# EAGLE schematic PDU_v3.1 (EAGLE 9.6.2)

## Sheet 1 of 11: PC104 Header
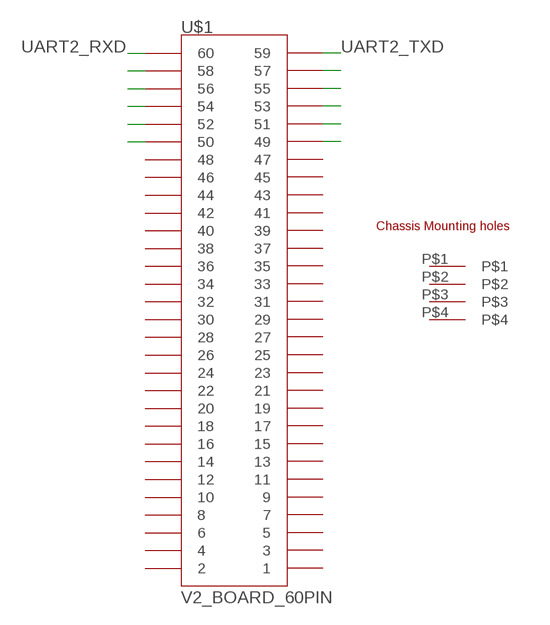
[diagram p0: schematic, sheet 1]

### Parts
U$1  V2_BOARD_60PIN  [PC104_WCONN_BACKPLANE_HEADER]

### Nets
N$22: U$1.57
N$23: U$1.55
N$24: U$1.53
N$32: U$1.58
N$33: U$1.56
N$34: U$1.54
N$35: U$1.52
N$36: U$1.51
N$37: U$1.49
N$39: U$1.50
UART2_RXD: U$1.60 ; also sheet 2
UART2_TXD: U$1.59 ; also sheet 2
Unconnected: U$1.1 U$1.2 U$1.3 U$1.4 U$1.5 U$1.6 U$1.7 U$1.8 U$1.9 U$1.10 U$1.11 U$1.12 U$1.13 U$1.14 U$1.15 U$1.16 U$1.17 U$1.18 U$1.19 U$1.20 U$1.21 U$1.22 U$1.23 U$1.24 U$1.25 U$1.26 U$1.27 U$1.28 U$1.29 U$1.30 U$1.31 U$1.32 U$1.33 U$1.34 U$1.35 U$1.36 U$1.37 U$1.38 U$1.39 U$1.40 U$1.41 U$1.42 U$1.43 U$1.44 U$1.45 U$1.46 U$1.47 U$1.48 U$1.P$1 U$1.P$2 U$1.P$3 U$1.P$4

## Sheet 2 of 11: Connectors
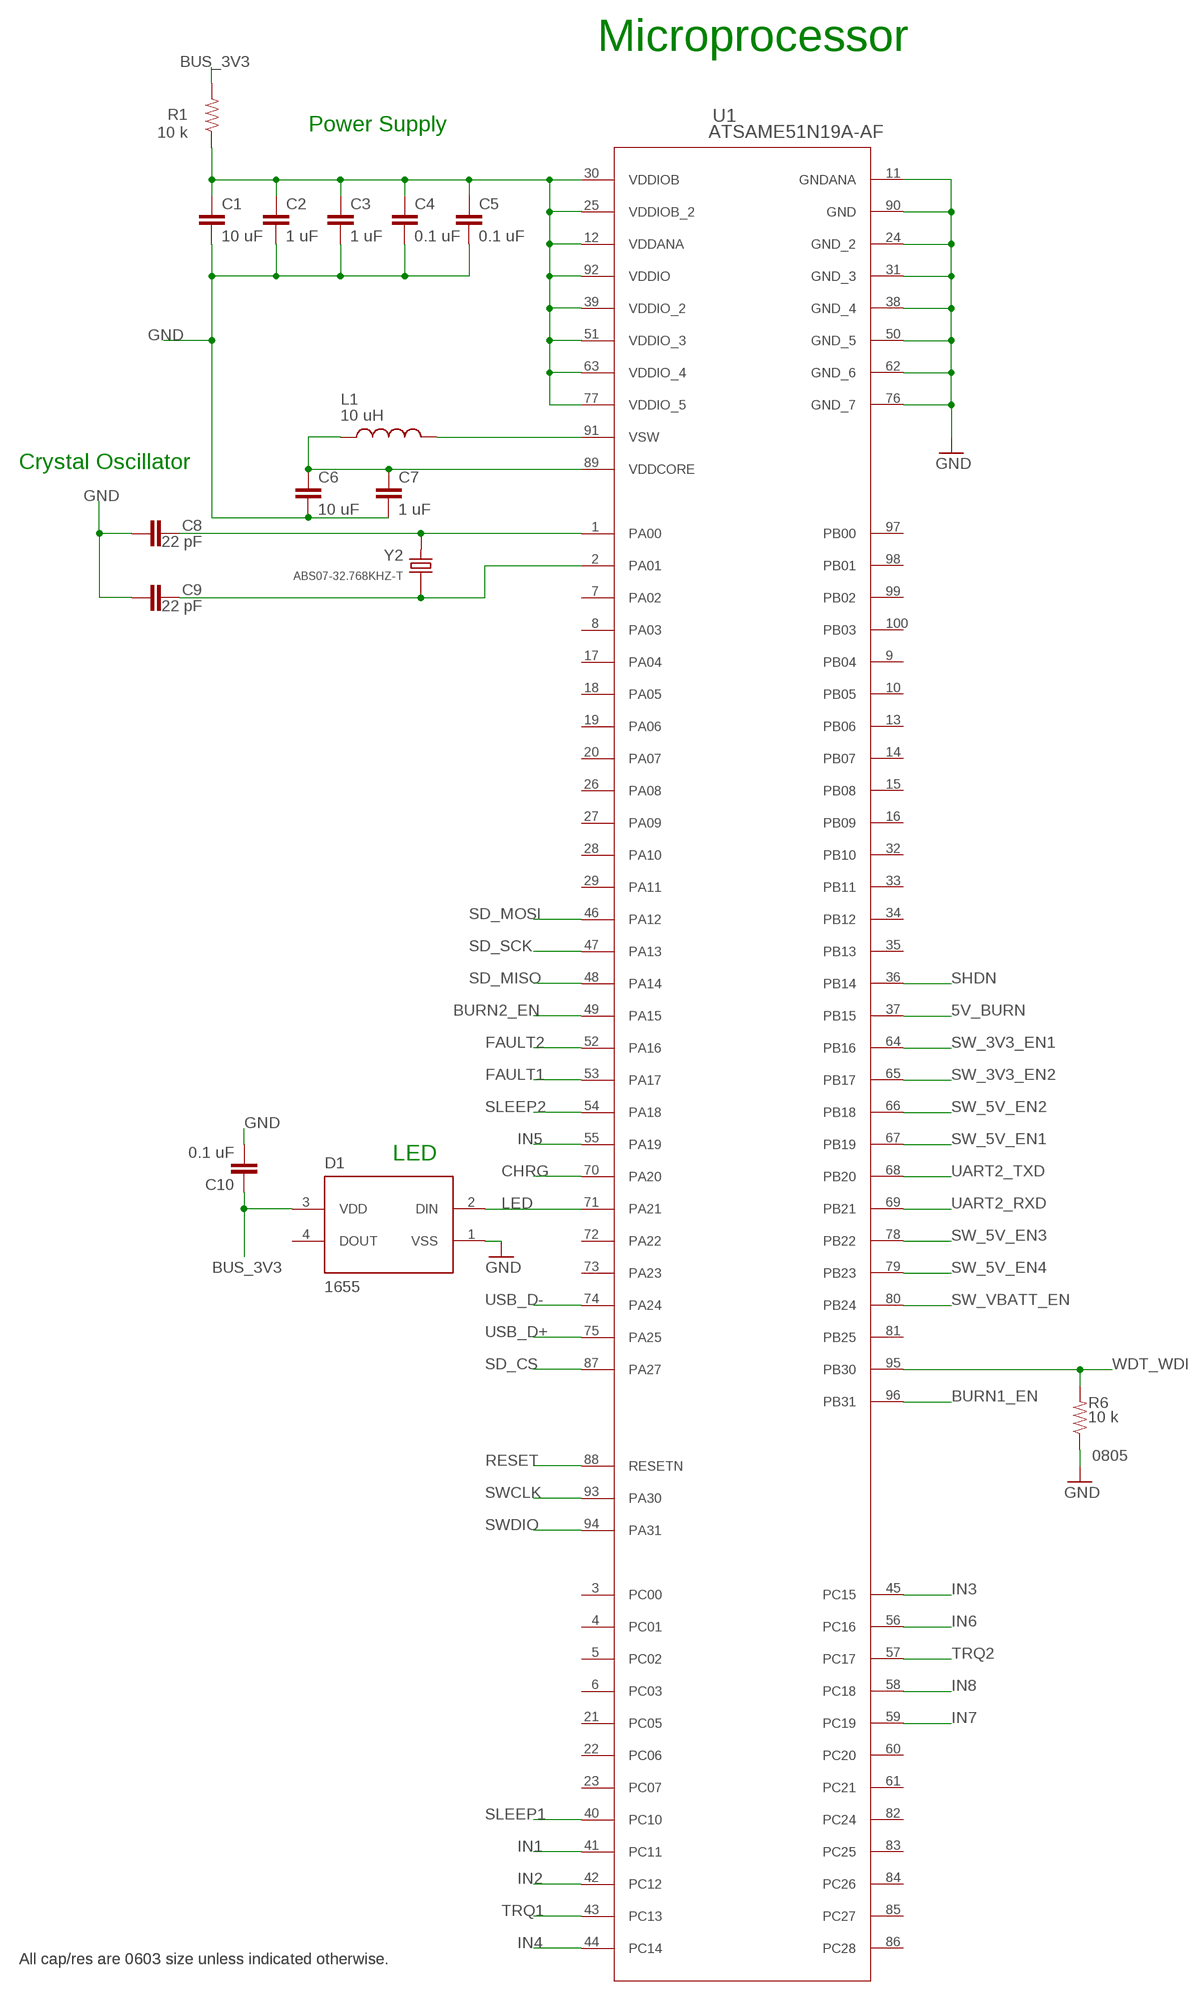
[diagram p1: schematic, sheet 2]

### Parts
C1  10 uF  CAP0603-CAP  [0603-CAP]
C2  1 uF  CAP0603-CAP  [0603-CAP]
C3  1 uF  CAP0603-CAP  [0603-CAP]
C4  0.1 uF  CAP0603-CAP  [0603-CAP]
C5  0.1 uF  CAP0603-CAP  [0603-CAP]
C6  10 uF  CAP0603-CAP  [0603-CAP]
C7  1 uF  CAP0603-CAP  [0603-CAP]
C8  22 pF  CAP0603-CAP  [0603-CAP]
C9  22 pF  CAP0603-CAP  [0603-CAP]
C10  0.1 uF  CAP0603-CAP  [0603-CAP]
D1  1655  [LED_1655]
L1  10 uH  CBL2012T100M  [INDC2012X100N]
R1  10 k  RESISTOR0603-RES  [0603-RES]
R6  10 k  RESISTOR0805-RES  [0805]
U1  ATSAME51N19A-AF  [TQFP100_14X14MC_MCH]
Y2  ABS07-32.768KHZ-T  [XTAL_ABS07-32.768KHZ-T]

### Nets
5V_BURN: U1.37(PB15)
BURN1_EN: U1.96(PB31)
BURN2_EN: U1.49(PA15)
BUS_3V3: C10.1 D1.3(VDD) R1.2
CCO_2: C8.2 U1.1(PA00) Y2.2
CCO_3: C9.2 U1.2(PA01) Y2.1
CHRG: U1.70(PA20)
FAULT1: U1.53(PA17)
FAULT2: U1.52(PA16)
GND: C1.2 C2.2 C3.2 C4.2 C5.2 C6.2 C7.2 C8.1 C9.1 C10.2 D1.1(VSS) R6.1 U1.11(GNDANA) U1.24(GND_2) U1.31(GND_3) U1.38(GND_4) U1.50(GND_5) U1.62(GND_6) U1.76(GND_7) U1.90(GND) ; also sheet 3
IN1: U1.41(PC11)
IN2: U1.42(PC12)
IN3: U1.45(PC15)
IN4: U1.44(PC14)
IN5: U1.55(PA19)
IN6: U1.56(PC16)
IN7: U1.59(PC19)
IN8: U1.58(PC18)
LED: D1.2(DIN) U1.71(PA21)
N$1: C6.1 C7.1 L1.1 U1.89(VDDCORE)
N$2: L1.2 U1.91(VSW)
RESET: U1.88(RESETN)
SD_CS: U1.87(PA27)
SD_MISO: U1.48(PA14)
SD_MOSI: U1.46(PA12)
SD_SCK: U1.47(PA13)
SHDN: U1.36(PB14)
SLEEP1: U1.40(PC10)
SLEEP2: U1.54(PA18)
SW_3V3_EN1: U1.64(PB16)
SW_3V3_EN2: U1.65(PB17)
SW_5V_EN1: U1.67(PB19)
SW_5V_EN2: U1.66(PB18)
SW_5V_EN3: U1.78(PB22)
SW_5V_EN4: U1.79(PB23)
SW_VBATT_EN: U1.80(PB24)
SWCLK: U1.93(PA30)
SWDIO: U1.94(PA31)
TRQ1: U1.43(PC13)
TRQ2: U1.57(PC17)
UART2_RXD: U1.69(PB21) ; also sheet 1
UART2_TXD: U1.68(PB20) ; also sheet 1
USB_D+: U1.75(PA25)
USB_D-: U1.74(PA24)
VDD2: C1.1 C2.1 C3.1 C4.1 C5.1 R1.1 U1.12(VDDANA) U1.25(VDDIOB_2) U1.30(VDDIOB) U1.39(VDDIO_2) U1.51(VDDIO_3) U1.63(VDDIO_4) U1.77(VDDIO_5) U1.92(VDDIO)
WDT_WDI: R6.2 U1.95(PB30)
Unconnected: D1.4(DOUT) U1.3(PC00) U1.4(PC01) U1.5(PC02) U1.6(PC03) U1.7(PA02) U1.8(PA03) U1.9(PB04) U1.10(PB05) U1.13(PB06) U1.14(PB07) U1.15(PB08) U1.16(PB09) U1.17(PA04) U1.18(PA05) U1.19(PA06) U1.20(PA07) U1.21(PC05) U1.22(PC06) U1.23(PC07) U1.26(PA08) U1.27(PA09) U1.28(PA10) U1.29(PA11) U1.32(PB10) U1.33(PB11) U1.34(PB12) U1.35(PB13) U1.60(PC20) U1.61(PC21) U1.72(PA22) U1.73(PA23) U1.81(PB25) U1.82(PC24) U1.83(PC25) U1.84(PC26) U1.85(PC27) U1.86(PC28) U1.97(PB00) U1.98(PB01) U1.99(PB02) U1.100(PB03)

### Notes on the sheet
- Microprocessor
- Power Supply
- Crystal Oscillator
- LED
- 0805
- All cap/res are 0603 size unless indicated otherwise. | All cap/res are 0603 size unless indicated otherwise.

## Sheet 3 of 11: H-Bridge Circuits
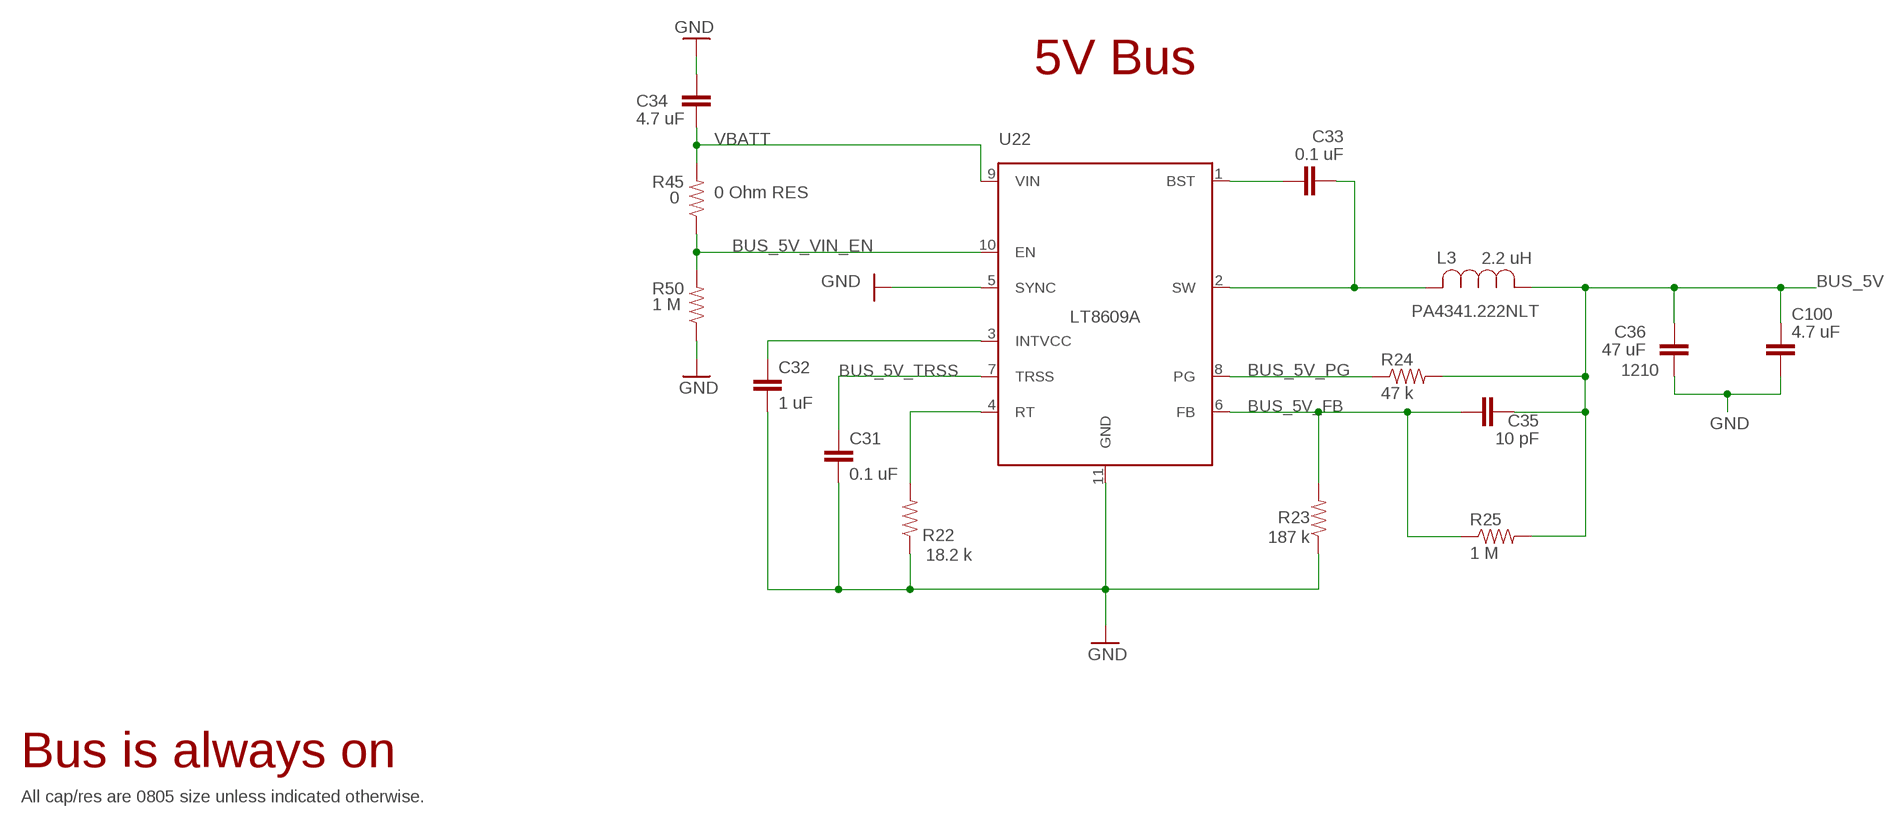
[diagram p2: schematic, sheet 3]

### Parts
C31  0.1 uF  CAP0805  [0805]
C32  1 uF  CAP0805  [0805]
C33  0.1 uF  CAP0805  [0805]
C34  4.7 uF  CAP0805  [0805]
C35  10 pF  CAP0805  [0805]
C36  47 uF  CAP1210  [1210]
C100  4.7 uF  CAP0805  [0805]
L3  PA4341.222NLT  [IND_222NLT_PUL]
R22  18.2 k  RESISTOR0805-RES  [0805]
R23  187 k  RESISTOR0805-RES  [0805]
R24  47 k  RESISTOR0805-RES  [0805]
R25  1 M  RESISTOR0805-RES  [0805]
R45  0  RESISTOR0805-RES  [0805]
R50  1 M  RESISTOR0805-RES  [0805]
U22  LT8609A  [MSOP-10_MSE]

### Nets
BUS_5V: C35.2 C36.1 C100.1 L3.1 R24.2 R25.2
BUS_5V_FB: C35.1 R23.2 R25.1 U22.6(FB)
BUS_5V_PG: R24.1 U22.8(PG)
BUS_5V_TRSS: C31.1 U22.7(TRSS)
BUS_5V_VIN_EN: R45.1 R50.2 U22.10(EN)
GND: C31.2 C32.2 C34.2 C36.2 C100.2 R22.1 R23.1 R50.1 U22.5(SYNC) U22.11(GND) ; also sheet 2
N$25: R22.2 U22.4(RT)
N$27: C32.1 U22.3(INTVCC)
N$28: C33.1 U22.1(BST)
N$29: C33.2 L3.2 U22.2(SW)
VBATT: C34.1 R45.2 U22.9(VIN)

### Notes on the sheet
- 5V Bus
- 0 Ohm RES
- 2.2 uH
- 1210
- Bus is always on
- All cap/res are 0805 size unless indicated otherwise.

## Sheet 4 of 11: Switches 1

### Notes on the sheet
- Switches (3V3, 5V, VBATT)

## Sheet 5 of 11: Switches 2

## Sheet 6 of 11: Bus (3V3, 5V)

## Sheet 7 of 11: 5V Burn

## Sheet 8 of 11: Microprocessor

## Sheet 9 of 11: Sensors (Current, Temperature)

## Sheet 10 of 11: Battery Charging

## Sheet 11 of 11

## Library data of the parts
C1-C10 C31-C36 C100 = HSFL_Main_Library:CAP: Capacitor Standard 0603 ceramic capacitor, and 0.1" leaded capacitor.
D1 = Artemis:1655: Ws2812b 5050 Rgb Led With Integrated Driver Chip Pack Of 10; DESCRIPTION: Ws2812b 5050 Rgb Led With Integrated Driver Chip Pack Of 10; MF: Adafruit; MP: 1655; PACKAGE: Adafruit
L1 = Artemis:CBL2012T100M: Power Inductor; Inductor Type:Power; Series:CBL; Inductance:10µH; Inductance Tolerance:± 20%; DC Resistance Max:1.3ohm; DC Current Rating:205mA; Package/Case:0805; Current Rating:205mA; Leaded Process Compatible:Yes ;RoHS Compliant: Yes; DESCRIPTION: 10µH Unshielded Wirewound Inductor 370mA 1.3Ohm Max 0805 (2012 Metric); DIGI-KEY_PART_NUMBER: 587-1632-1-ND; MF: Taiyo Yuden; MP: CBL2012T100M; PACKAGE: 2012 Taiyo Yuden
L3 = Artemis:PA4341.222NLT; COPYRIGHT: Copyright (C) 2021 Ultra Librarian. All rights reserved.; DIGI-KEY_PART_NUMBER_1: 553-3409-2-ND; DIGI-KEY_PART_NUMBER_2: 553-3409-1-ND; DIGI-KEY_PART_NUMBER_3: 553-3409-6-ND; MANUFACTURER_PART_NUMBER: PA4341.222NLT; MFR_NAME: Pulse Electronics Corporation
R1 R6 R22-R25 R45 R50 = HSFL_Main_Library:RESISTOR: Resistor Basic schematic elements and footprints for 0603, 1206, and PTH resistors.
U1 = Artemis:ATSAME51N19A-AF; BUILT_BY: EMA_Molly; COPYRIGHT: Copyright (C) 2018 Accelerated Designs. All rights reserved; MANUFACTURER_PART_NUMBER: ATSAME51N19A-AF; SOURCELIBRARY: Microchip_2019-08-23_25; VENDOR: Microchip
U22 = HSFL_Main_Library:LT8609A
U$1 = Artemis v2 board:V2_BOARD_60PIN
Y2 = Artemis:ABS07-32.768KHZ-T: ABS07 Series 32.768 kHz ±20 ppm 12.5 pF -40 to +85 °C SMT Low Profile Crystal; DESCRIPTION: 32.768kHz ±20ppm Crystal 12.5pF 70 kOhms 2-SMD, No Lead; DIGI-KEY_PART_NUMBER: 535-9542-1-ND; MF: Abracon; MP: ABS07-32.768KHZ-T; PACKAGE: SMD-2 Abracon LLC; PURCHASE-URL: https://pricing.snapeda.com/search/part/ABS07-32.768KHZ-T/?ref=eda